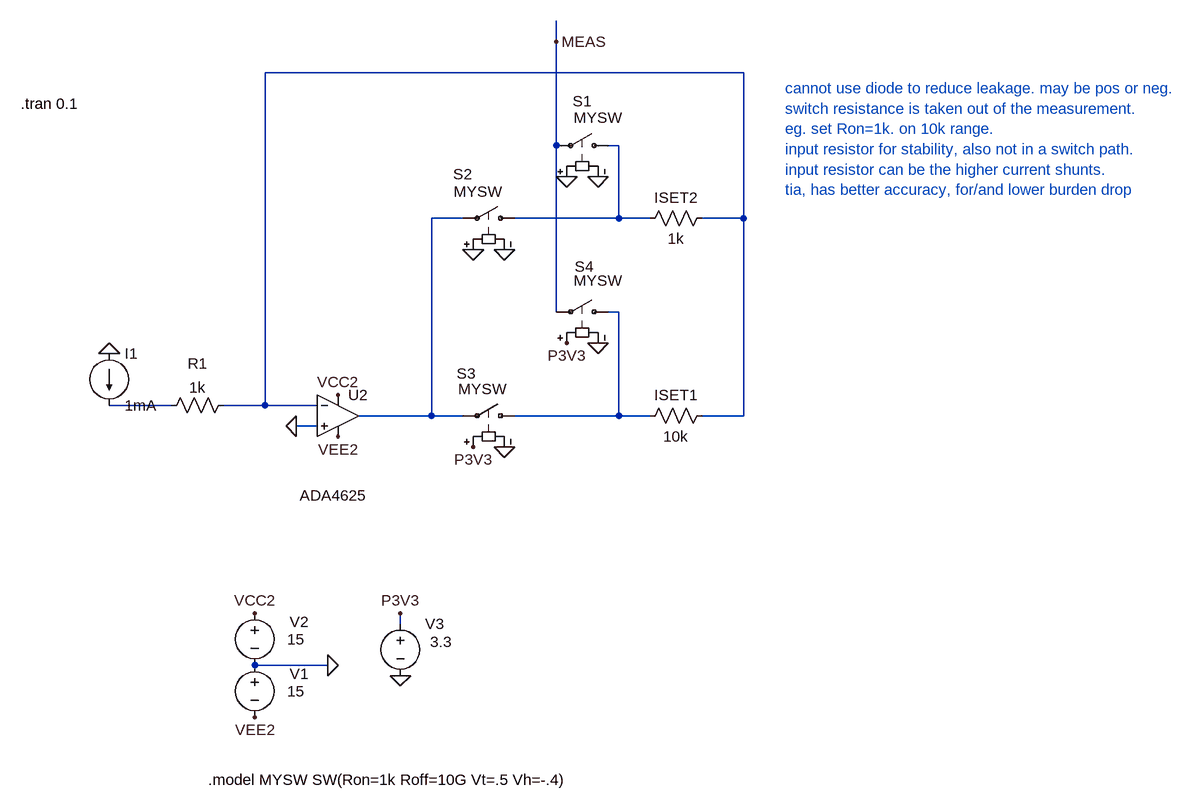
[diagram p0: schematic Draft21.asc]
Draft21.asc, the LTspice schematic file:
Version 4
SHEET 1 1768 872
WIRE 752 -448 752 -480
WIRE 1040 -400 304 -400
WIRE 752 -288 752 -448
WIRE 848 -288 832 -288
WIRE 608 -176 560 -176
WIRE 848 -176 848 -288
WIRE 848 -176 688 -176
WIRE 896 -176 848 -176
WIRE 1040 -176 1040 -400
WIRE 1040 -176 976 -176
WIRE 752 -32 752 -288
WIRE 848 -32 832 -32
WIRE 160 112 64 112
WIRE 304 112 304 -400
WIRE 304 112 240 112
WIRE 384 112 304 112
WIRE 560 128 560 -176
WIRE 560 128 448 128
WIRE 608 128 560 128
WIRE 848 128 848 -32
WIRE 848 128 688 128
WIRE 896 128 848 128
WIRE 1040 128 1040 -176
WIRE 1040 128 976 128
WIRE 384 144 352 144
WIRE 512 448 512 432
WIRE 400 512 288 512
FLAG 400 512 0
FLAG 288 592 VEE2
FLAG 288 432 VCC2
FLAG 416 160 VEE2
FLAG 512 528 0
FLAG 512 432 P3V3
FLAG 64 32 0
FLAG 352 144 0
FLAG 672 176 0
FLAG 672 -128 0
FLAG 816 -240 0
FLAG 816 16 0
FLAG 768 -240 0
FLAG 624 -128 0
FLAG 624 176 P3V3
FLAG 768 16 P3V3
FLAG 416 96 VCC2
FLAG 752 -448 MEAS
SYMBOL voltage 288 496 R0
WINDOW 0 54 29 Left 2
WINDOW 3 50 56 Left 2
WINDOW 123 0 0 Left 0
WINDOW 39 0 0 Left 0
SYMATTR InstName V1
SYMATTR Value 15
SYMBOL voltage 288 416 R0
WINDOW 0 54 29 Left 2
WINDOW 3 50 56 Left 2
WINDOW 123 0 0 Left 0
WINDOW 39 0 0 Left 0
SYMATTR InstName V2
SYMATTR Value 15
SYMBOL OpAmps\\ADA4625 416 64 R0
WINDOW 3 -59 187 Left 2
SYMATTR InstName U2
SYMBOL voltage 512 432 R0
WINDOW 123 0 0 Left 0
WINDOW 39 0 0 Left 0
WINDOW 3 46 44 Left 2
WINDOW 0 38 16 Left 2
SYMATTR Value 3.3
SYMATTR InstName V3
SYMBOL current 64 32 R0
WINDOW 123 0 0 Left 0
WINDOW 39 0 0 Left 0
SYMATTR InstName I1
SYMATTR Value 1mA
SYMBOL res 256 96 R90
WINDOW 0 -33 56 VBottom 2
WINDOW 3 -27 56 VTop 2
SYMATTR InstName R1
SYMATTR Value 1k
SYMBOL res 992 112 R90
WINDOW 0 0 56 VBottom 2
WINDOW 3 32 56 VTop 2
SYMATTR InstName ISET1
SYMATTR Value 10k
SYMBOL res 992 -192 R90
WINDOW 0 0 56 VBottom 2
WINDOW 3 32 56 VTop 2
SYMATTR InstName ISET2
SYMATTR Value 1k
SYMBOL sw 848 -288 M270
WINDOW 0 68 71 VLeft 2
WINDOW 3 43 69 VLeft 2
SYMATTR InstName S1
SYMATTR Value MYSW
SYMBOL sw 704 -176 M270
WINDOW 0 68 111 VLeft 2
WINDOW 3 41 110 VLeft 2
SYMATTR InstName S2
SYMATTR Value MYSW
SYMBOL sw 704 128 M270
WINDOW 0 65 105 VLeft 2
WINDOW 3 41 103 VLeft 2
SYMATTR InstName S3
SYMATTR Value MYSW
SYMBOL sw 848 -32 M270
WINDOW 0 70 68 VLeft 2
WINDOW 3 48 69 VLeft 2
SYMATTR InstName S4
SYMATTR Value MYSW
TEXT -72 -352 Left 2 !.tran 0.1
TEXT 216 688 Left 2 !.model MYSW SW(Ron=1k Roff=10G Vt=.5 Vh=-.4)
TEXT 1104 -376 Left 2 ;cannot use diode to reduce leakage. may be pos or neg.\nswitch resistance is taken out of the measurement.\neg. set Ron=1k. on 10k range.\ninput resistor for stability, also not in a switch path.\ninput resistor can be the higher current shunts.\ntia, has better accuracy, for/and lower burden drop

The netlist it stands for:
* Draft21.asc
V1 0 VEE2 15
V2 VCC2 0 15
XU2 0 N001 VCC2 VEE2 N003 ADA4625  ; pins In+ In- V+ V- OUT
V3 P3V3 0 3.3
I1 0 N005 1mA
R1 N001 N005 1k
R§ISET1 N001 N004 10k
R§ISET2 N001 N002 1k
S1 N002 MEAS 0 0 MYSW
S2 N002 N003 0 0 MYSW
S3 N004 N003 P3V3 0 MYSW
S4 N004 MEAS P3V3 0 MYSW
.tran 0.1
.model MYSW SW(Ron=1k Roff=10G Vt=.5 Vh=-.4)
* cannot use diode to reduce leakage. may be pos or neg.
* switch resistance is taken out of the measurement.
* eg. set Ron=1k. on 10k range.
* input resistor for stability, also not in a switch path.
* input resistor can be the higher current shunts.
* tia, has better accuracy, for/and lower burden drop
.backanno
.end